# Altium schematic sheet Main Sheet.SchDoc
size A3
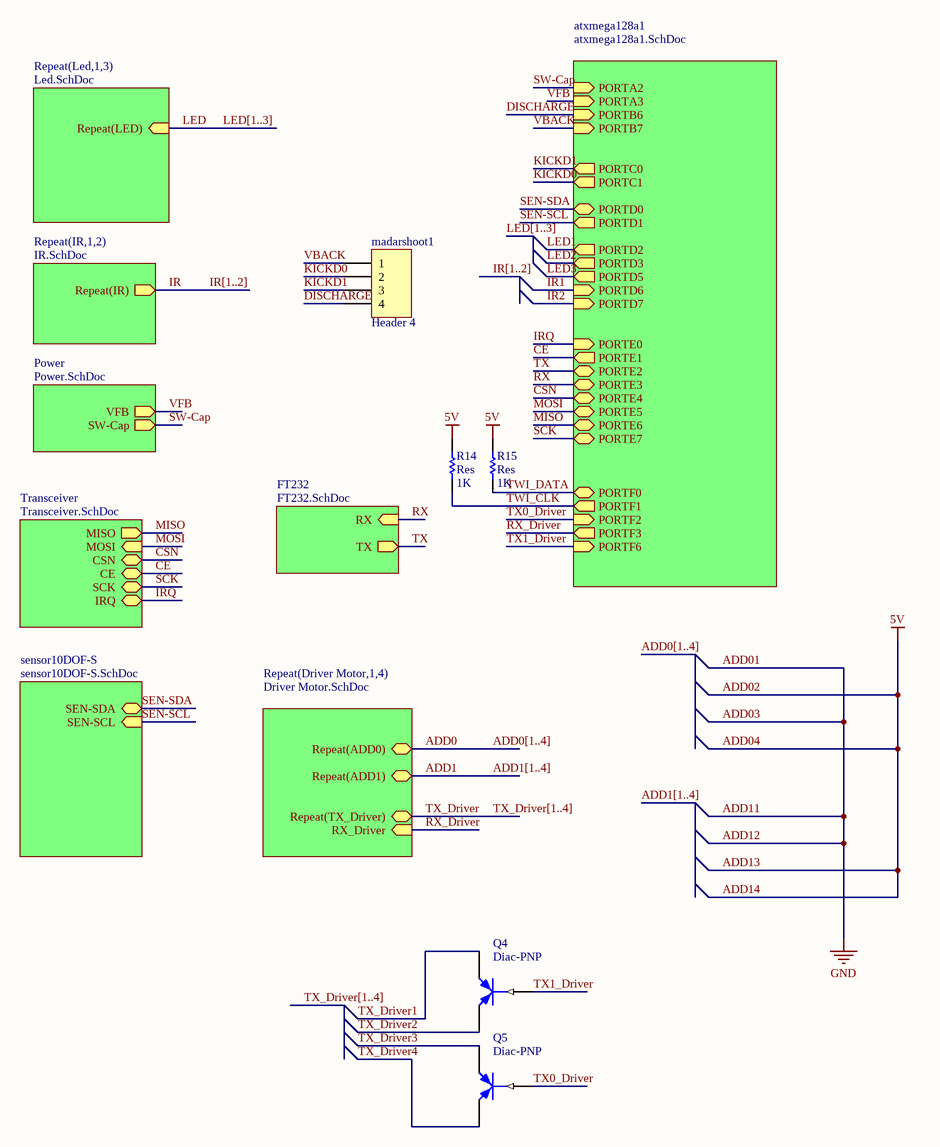
[diagram p0: Main Sheet.SchDoc]

## Parts
madarshoot1  Header 4  [sucket-smd-4pin]
Q4  Diac-PNP  [Diode-comcathod]
Q5  Diac-PNP  [Diode-comcathod]
R14  Res  value 1K  [2012[0805]]
R15  Res  value 1K  [2012[0805]]

## Sub-sheets
atxmega128a1 = atxmega128a1.SchDoc: PORTD5 (out), PORTD6 (in), PORTD7 (in), PORTD2 (out), PORTA3 (in), PORTE0 (in), PORTE1 (out), PORTE2, PORTB6 (in), PORTB7 (in), PORTC0 (out), PORTC1 (out), PORTF0 (bidir), PORTF1 (out), PORTE3, PORTE4, PORTE5, PORTE6, PORTE7, PORTA2 (in), PORTD3 (out), PORTD0, PORTD1 (out), PORTF2 (in), PORTF3 (out), PORTF6 (in)
FT232 = FT232.SchDoc: RX (in), TX (out)
Power = Power.SchDoc: VFB (out), SW-Cap (out)
Repeat(Driver Motor,1,4) = Driver Motor.SchDoc: Repeat(ADD0), Repeat(ADD1), Repeat(TX_Driver), RX_Driver (in)
Repeat(IR,1,2) = IR.SchDoc: Repeat(IR) (out)
Repeat(Led,1,3) = Led.SchDoc: Repeat(LED) (in)
sensor10DOF-S = sensor10DOF-S.SchDoc: SEN-SDA, SEN-SCL (in)
Transceiver = Transceiver.SchDoc: MISO (out), MOSI (in), CSN, CE, SCK, IRQ

## Nets
ADD02: R14.2 R15.2  [also labelled 5V, ADD04, ADD13, ADD14]
ADD0: sheet Repeat(Driver Motor,1,4)/Repeat(ADD0)
ADD1: sheet Repeat(Driver Motor,1,4)/Repeat(ADD1)
CE: sheet atxmega128a1/PORTE1, sheet Transceiver/CE
CSN: sheet atxmega128a1/PORTE4, sheet Transceiver/CSN
DISCHARGE: madarshoot1.4 ; sheet atxmega128a1/PORTB6
IR: sheet Repeat(IR,1,2)/Repeat(IR)
IR1: sheet atxmega128a1/PORTD6
IR2: sheet atxmega128a1/PORTD7
IRQ: sheet atxmega128a1/PORTE0, sheet Transceiver/IRQ
KICKD0: madarshoot1.2 ; sheet atxmega128a1/PORTC1
KICKD1: madarshoot1.3 ; sheet atxmega128a1/PORTC0
LED: sheet Repeat(Led,1,3)/Repeat(LED)
LED1: sheet atxmega128a1/PORTD2
LED2: sheet atxmega128a1/PORTD3
LED3: sheet atxmega128a1/PORTD5
MISO: sheet atxmega128a1/PORTE6, sheet Transceiver/MISO
MOSI: sheet atxmega128a1/PORTE5, sheet Transceiver/MOSI
RX: sheet atxmega128a1/PORTE3, sheet FT232/RX
RX_Driver: sheet atxmega128a1/PORTF3, sheet Repeat(Driver Motor,1,4)/RX_Driver
SCK: sheet atxmega128a1/PORTE7, sheet Transceiver/SCK
SEN-SCL: sheet atxmega128a1/PORTD1, sheet sensor10DOF-S/SEN-SCL
SEN-SDA: sheet atxmega128a1/PORTD0, sheet sensor10DOF-S/SEN-SDA
SW-Cap: sheet atxmega128a1/PORTA2, sheet Power/SW-Cap
TWI_CLK: R14.1 ; sheet atxmega128a1/PORTF1
TWI_DATA: R15.1 ; sheet atxmega128a1/PORTF0
TX: sheet atxmega128a1/PORTE2, sheet FT232/TX
TX0_Driver: Q5.1(B) ; sheet atxmega128a1/PORTF2
TX1_Driver: Q4.1(B) ; sheet atxmega128a1/PORTF6
TX_Driver: sheet Repeat(Driver Motor,1,4)/Repeat(TX_Driver)
TX_Driver1: Q4.3(C)
TX_Driver2: Q4.2(E)
TX_Driver3: Q5.3(C)
TX_Driver4: Q5.2(E)
VBACK: madarshoot1.1 ; sheet atxmega128a1/PORTB7
VFB: sheet atxmega128a1/PORTA3, sheet Power/VFB

## Buses and harness runs
bus ADD0[1..4]
bus ADD1[1..4]
bus IR[1..2]
bus LED[1..3]
bus TX_Driver[1..4]

## Notes on the sheet
- Title
- Size:
- Date:
- A3
- Number:
- Time:
- Revision:
- Sheet
- of
- File:

## Library data of the parts
madarshoot1 = Header 4: Header, 4-Pin; LatestRevisionDate: 17-Jul-2002; LatestRevisionNote: Re-released for DXP Platform.; Publisher: Altium Limited
Q4 Q5 = Diac-PNP: DIAC; Published: 24-Mar-1999; LatestRevisionDate: 29-May-2009; LatestRevisionNote: IPC-7351 Footprint Added.; PackageVersion: Jul-2004; PackageReference: SOT89; Publisher: Altium Limited; PackageDescription: 3-Pin SOT-89 Package 1.5 mm Pitch, 4.1 mm Lead Span; Code_JEDEC: TO-243-AA
R14 R15 = Res: Semiconductor Resistor; Published: 8-Jun-2000; LatestRevisionDate: 17-Jul-2002; LatestRevisionNote: Re-released for DXP Platform.; PackageReference: AXIAL-0.5; Publisher: Altium Limited